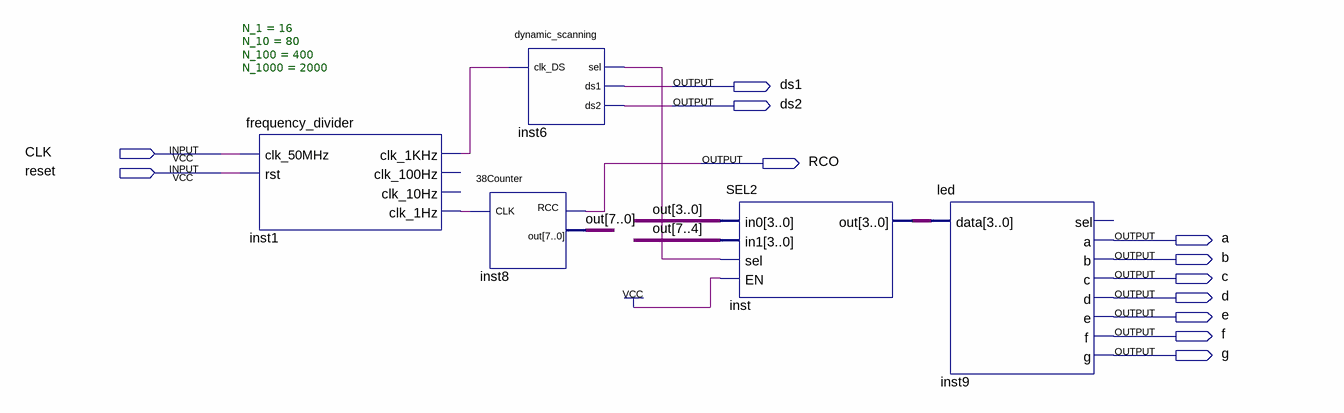
[diagram p0: schematic sheet]
// Quartus schematic project6.bdf as structural Verilog: 5 symbols, 12 pins
module project6 (
  input  CLK,
  input  reset,
  output ds1,
  output ds2,
  output RCO,
  output a,
  output b,
  output c,
  output d,
  output e,
  output f,
  output g
);

  wire inst1_clk_1hz, inst1_clk_1khz, inst6_sel;
  wire [3:0] inst_out;
  wire [7:0] out;

  frequency_divider #(.N_1(16), .N_10(80), .N_100(400), .N_1000(2000)) inst1 (
    .clk_50MHz(CLK), .rst(reset), .clk_1KHz(inst1_clk_1khz), .clk_1Hz(inst1_clk_1hz));  // open: clk_100Hz, clk_10Hz
  \38Counter  inst8 (.CLK(inst1_clk_1hz), .RCC(RCO), .out(out));
  dynamic_scanning inst6 (.clk_DS(inst1_clk_1khz), .sel(inst6_sel), .ds1(ds1), .ds2(ds2));
  SEL2 inst (.in0(out[3:0]), .in1(out[7:4]), .sel(inst6_sel), .EN(1'b1), .out(inst_out));
  led inst9 (.data(inst_out), .a(a), .b(b), .c(c), .d(d), .e(e), .f(f), .g(g));  // open: sel
endmodule
